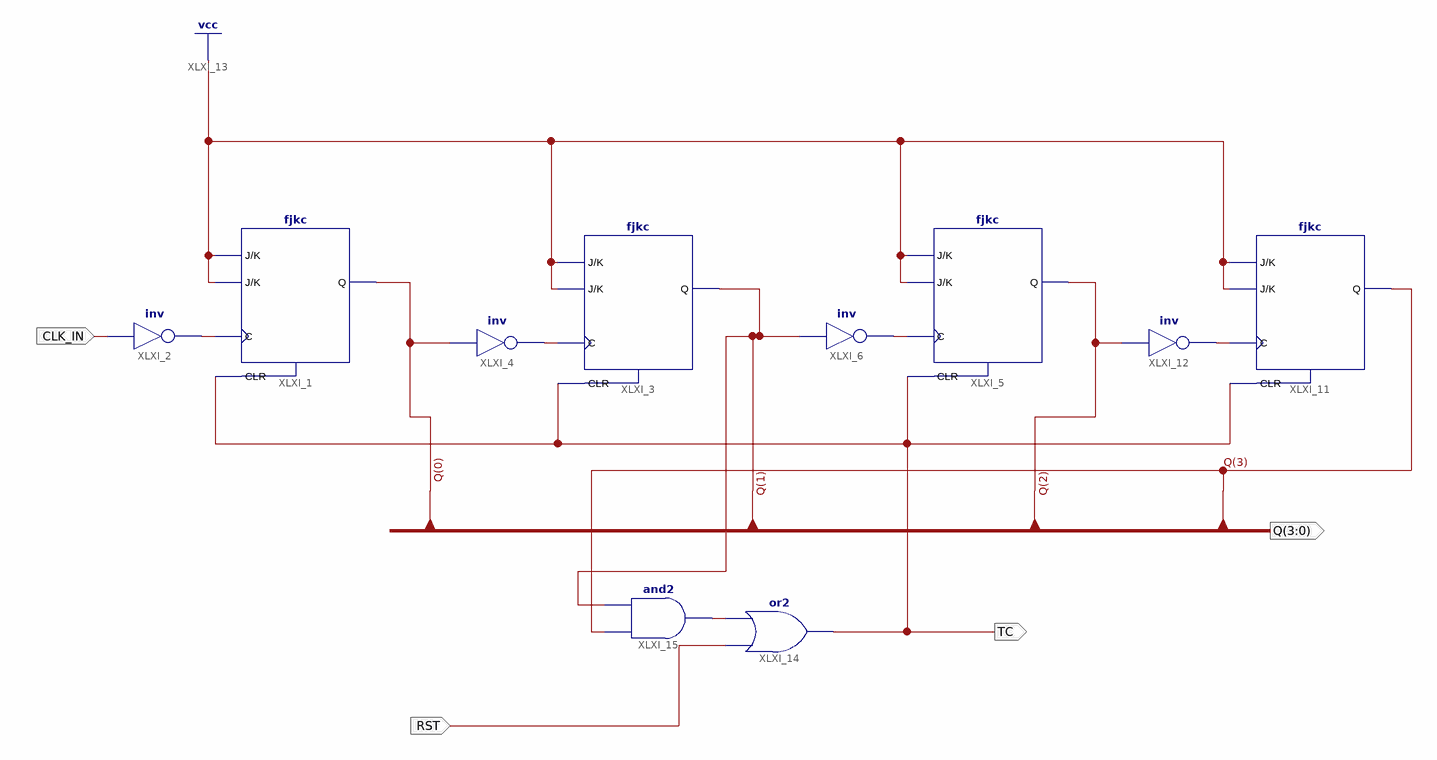
[diagram p0: schematic sheet 1]
// Xilinx ISE schematic Counter0_9.sch (spartan6) as structural Verilog: 10 symbols, 4 ports
module Counter0_9 (
  input  RST,
  input  CLK_IN,
  output TC,
  output [3:0] Q
);

  wire XLXN_1, XLXN_2, XLXN_3, XLXN_6, XLXN_18;

  fjkc XLXI_1 (.C(XLXN_1), .CLR(TC), .J(1'b1), .K(1'b1), .Q(Q[0]));
  not XLXI_2 (XLXN_1, CLK_IN);
  fjkc XLXI_3 (.C(XLXN_2), .CLR(TC), .J(1'b1), .K(1'b1), .Q(Q[1]));
  not XLXI_4 (XLXN_2, Q[0]);
  fjkc XLXI_5 (.C(XLXN_3), .CLR(TC), .J(1'b1), .K(1'b1), .Q(Q[2]));
  not XLXI_6 (XLXN_3, Q[1]);
  fjkc XLXI_11 (.C(XLXN_6), .CLR(TC), .J(1'b1), .K(1'b1), .Q(Q[3]));
  not XLXI_12 (XLXN_6, Q[2]);
  or XLXI_14 (TC, RST, XLXN_18);
  and XLXI_15 (XLXN_18, Q[3], Q[1]);
endmodule
